# EasyEDA Pro project Steam Wand Attachment Controller.eprj

# Schematic Schematic1
Board Name: Board1; Create Date: 2025-08-12; Page Name: Steam Wand Schematic; Project Name: Steam Wand Attachment Controller; Schematic Name: Schematic1; Update Date: 2025-10-22; Company: EasyEDA.com; Page Size: A4; Version: V1.0
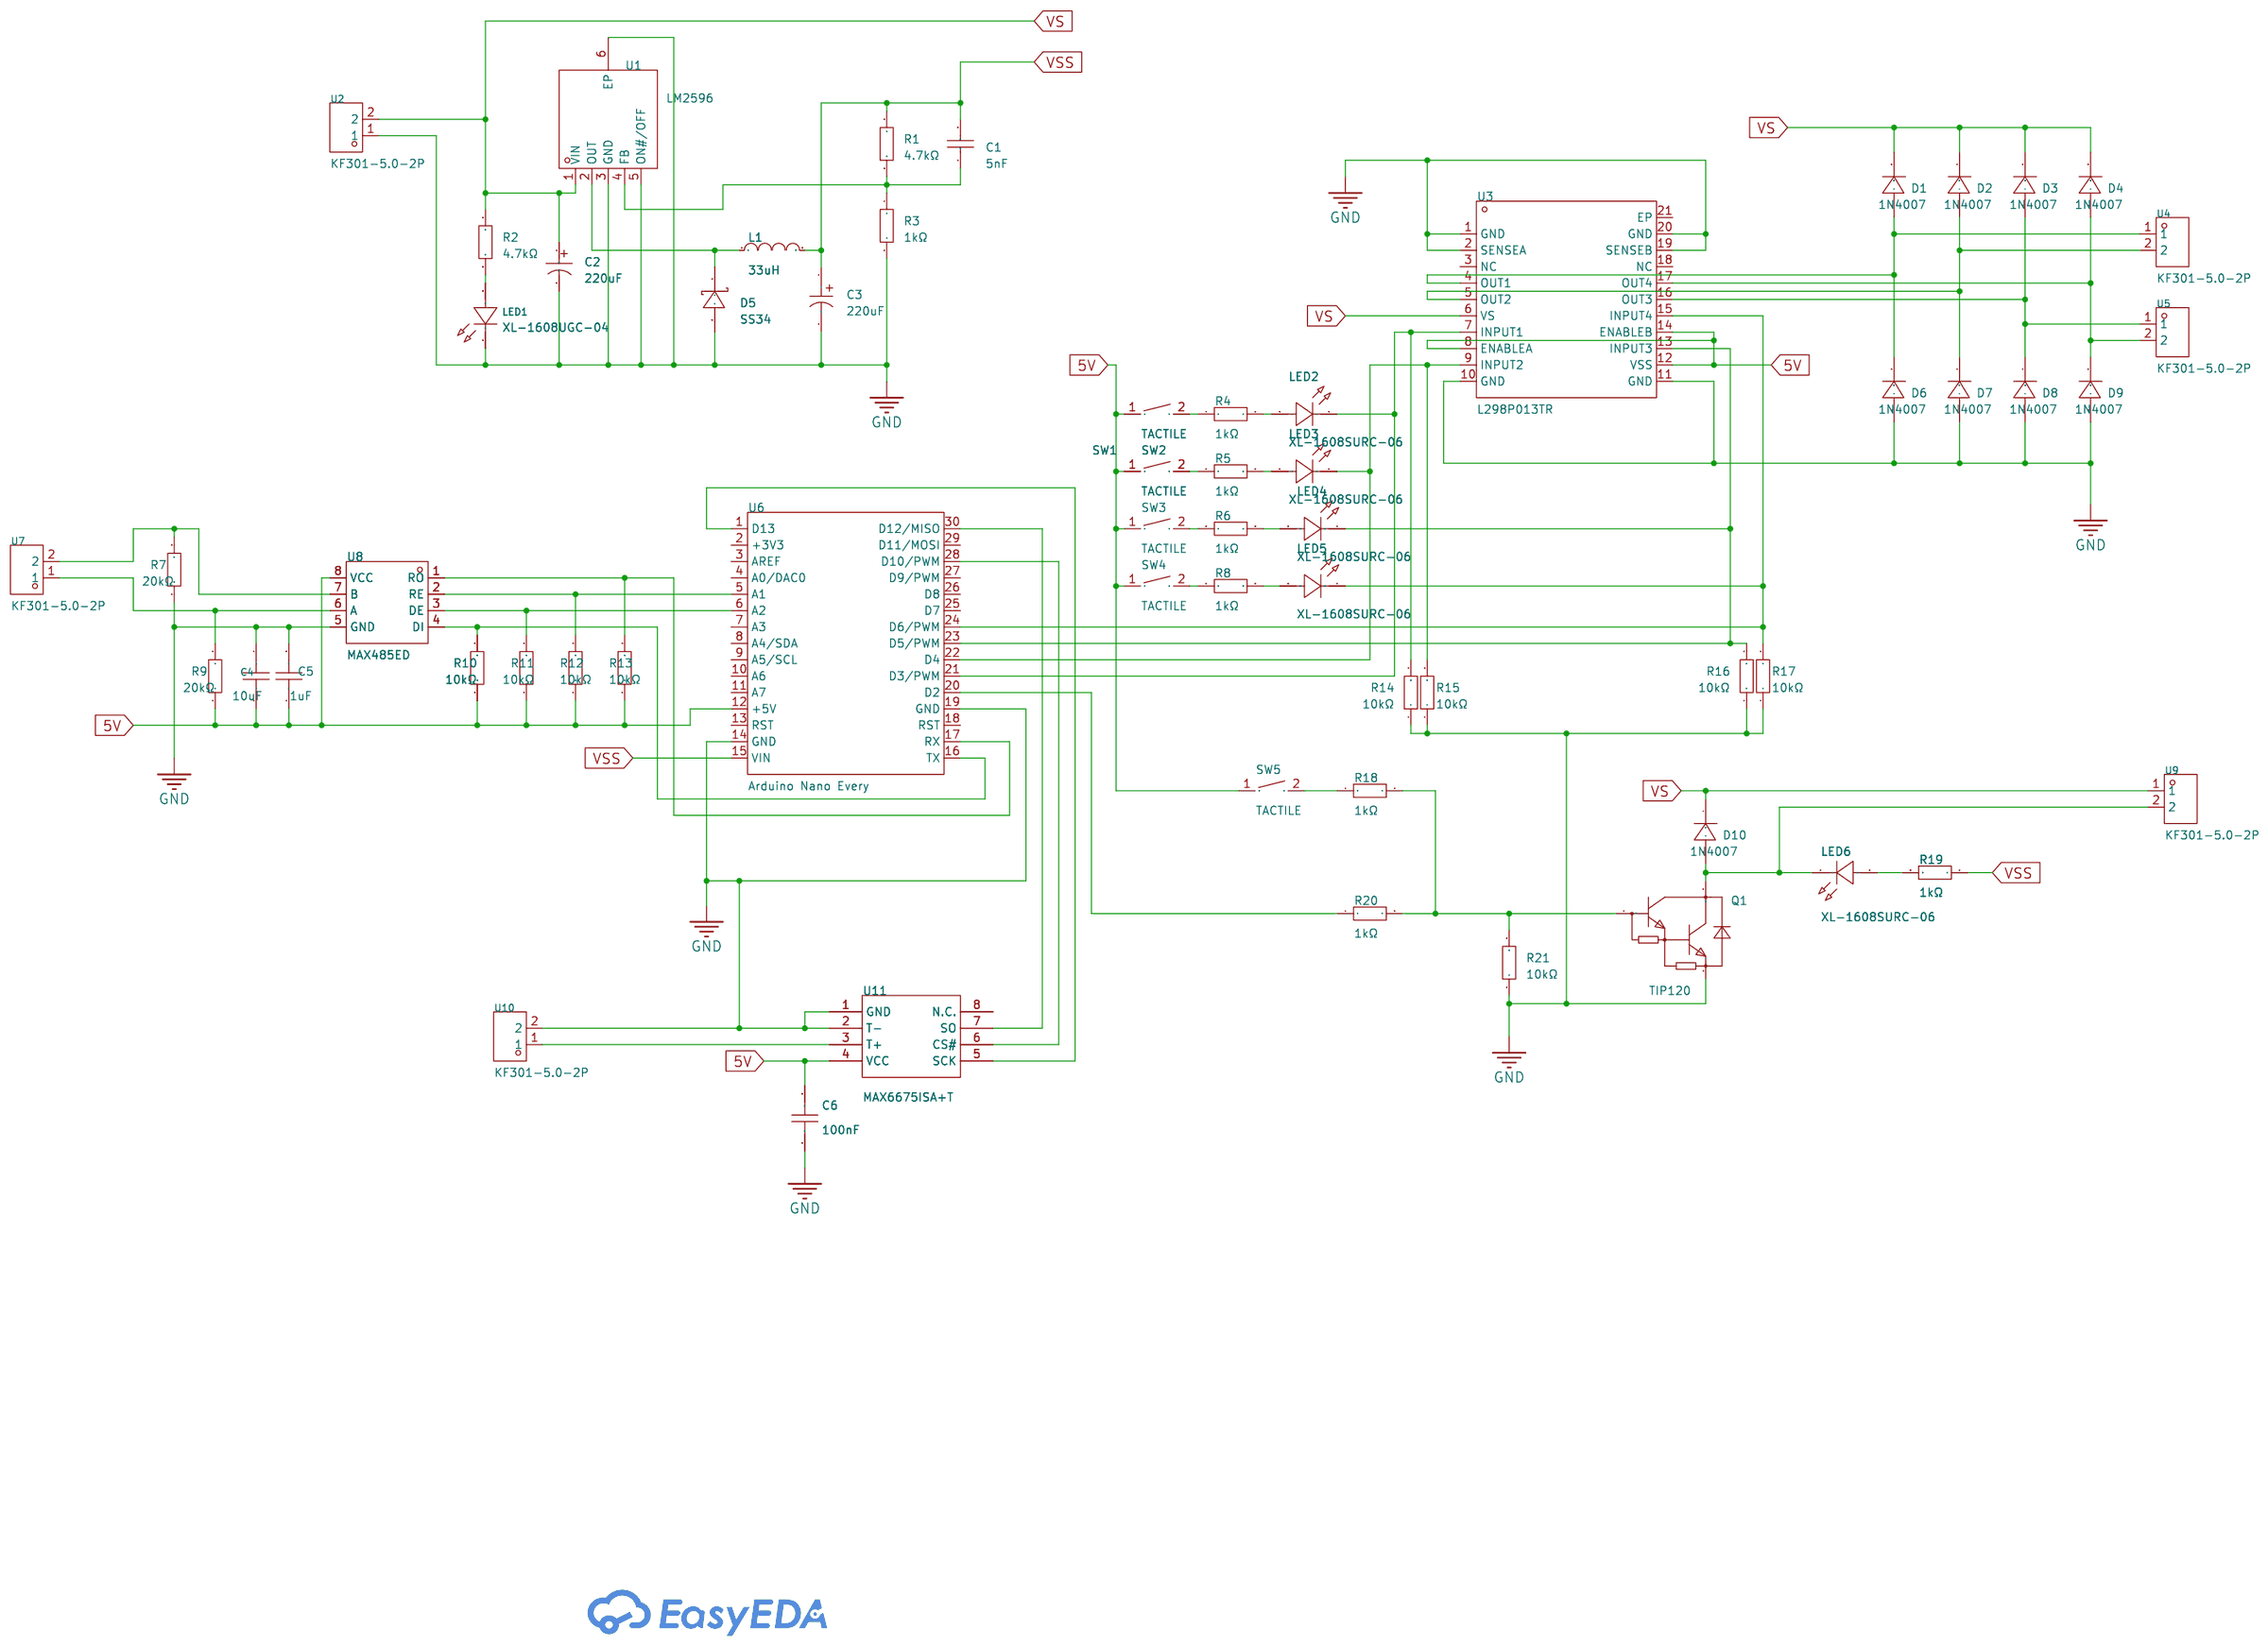
[diagram p0: schematic sheet]

## Parts
C1  5nF  [C0805]
C2  220uF  [CAP-SMD_BD10.0-L10.3-W10.3-LS11.3-FD]
C3  220uF  [CAP-SMD_BD6.3-L6.6-W6.6-LS7.4-FD]
C4  10uF  [C0603]
C5  1uF  [C0603]
C6  100nF  [C0603]
D1  1N4007  [SMAF_L3.5-W2.6-LS4.6-RD]
D2  1N4007  [SMAF_L3.5-W2.6-LS4.6-RD]
D3  1N4007  [SMAF_L3.5-W2.6-LS4.6-RD]
D4  1N4007  [SMAF_L3.5-W2.6-LS4.6-RD]
D5  SS34  [SMA_L4.3-W2.6-LS5.2-RD]
D6  1N4007  [SMAF_L3.5-W2.6-LS4.6-RD]
D7  1N4007  [SMAF_L3.5-W2.6-LS4.6-RD]
D8  1N4007  [SMAF_L3.5-W2.6-LS4.6-RD]
D9  1N4007  [SMAF_L3.5-W2.6-LS4.6-RD]
D10  1N4007  [SMAF_L3.5-W2.6-LS4.6-RD]
L1  33uH  [IND-SMD_L12.3-W12.3]
LED1  XL-1608UGC-04  [LED0603-RD_GREEN]
LED2  XL-1608SURC-06  [LED0603-RD_RED]
LED3  XL-1608SURC-06  [LED0603-RD_RED]
LED4  XL-1608SURC-06  [LED0603-RD_RED]
LED5  XL-1608SURC-06  [LED0603-RD_RED]
LED6  XL-1608SURC-06  [LED0603-RD_RED]
Q1  TIP120  [TO-220-3_L10.0-W4.5-P2.54-L]
R1  4.7kΩ  [R0603]
R2  4.7kΩ  [R0603]
R3  1kΩ  [R0603]
R4  1kΩ  [R0603]
R5  1kΩ  [R0603]
R6  1kΩ  [R0603]
R7  20kΩ  [R0603]
R8  1kΩ  [R0603]
R9  20kΩ  [R0603]
R10  10kΩ  [R0603]
R11  10kΩ  [R0603]
R12  10kΩ  [R0603]
R13  10kΩ  [R0603]
R14  10kΩ  [R0603]
R15  10kΩ  [R0603]
R16  10kΩ  [R0603]
R17  10kΩ  [R0603]
R18  1kΩ  [R0603]
R19  1kΩ  [R0603]
R20  1kΩ  [R0603]
R21  10kΩ  [R0603]
SW1  TACTILE  [KEY-SMD_L4.0-W3.0-LS4.9-1]
SW2  TACTILE  [KEY-SMD_L4.0-W3.0-LS4.9-1]
SW3  TACTILE  [KEY-SMD_L4.0-W3.0-LS4.9-1]
SW4  TACTILE  [KEY-SMD_L4.0-W3.0-LS4.9-1]
SW5  TACTILE  [KEY-SMD_L4.0-W3.0-LS4.9-1]
U1  LM2596  [TO-263-5_L10.2-W8.9-P1.70-BR]
U2  KF301-5.0-2P  [CONN-TH_P5.00_KF301-5.0-2P]
U3  L298P013TR  [POWERSO20_L15.9-W11.0-P1.27-LS14.2-BL-EP]
U4  KF301-5.0-2P  [CONN-TH_P5.00_KF301-5.0-2P]
U5  KF301-5.0-2P  [CONN-TH_P5.00_KF301-5.0-2P]
U6  Arduino Nano Every  [MOD-TH_ABX00028]
U7  KF301-5.0-2P  [CONN-TH_P5.00_KF301-5.0-2P]
U8  MAX485ED  [SOP-8_L4.9-W3.9-P1.27-LS6.0-BL]
U9  KF301-5.0-2P  [CONN-TH_P5.00_KF301-5.0-2P]
U10  KF301-5.0-2P  [CONN-TH_P5.00_KF301-5.0-2P]
U11  MAX6675ISA+T  [SOIC-8_L5.0-W4.0-P1.27-LS6.0-BL]

## Library data of the parts
C1 = 0805B502K500NT: Capacitance:5nF Tolerance:±10% Tolerance:±10% Voltage Rating:50V Temperature Coefficient:X7R; LCSC Part Name: 5nF ±10% 50V; Supplier Part: C1748; Manufacturer: FH(风华); Supplier Footprint: 0805; JLCPCB Part Class: Extended Part; Datasheet: https://atta.szlcsc.com/upload/public/pdf/source/20200305/C486355_26A10D38EF8C2A5C37091D0039909270.pdf; Supplier: LCSC; Tolerance: ±10%; Voltage Rating: 50V; Temperature Coefficient: X7R
C2 = RVT1H221M1010_C72499: Capacitance:220uF Tolerance:±20% Tolerance:±20% Voltage Rating:50V Ripple Current:230mA@120Hz Equivalent Series Resistance(ESR):- Diameter:10mm Height - Seated (Max):10.2mm Lifetime:2000hrs@105℃ Operating Temperature:-40℃~+105℃ Operating Temperature:-40℃~; LCSC Part Name: 220uF ±20% 50V; Supplier Part: C72499; Manufacturer: ROQANG(容强); Manufacturer Part: RVT1H221M1010; Supplier Footprint: SMD,D10xL10.2mm; JLCPCB Part Class: Extended Part; Datasheet: https://item.szlcsc.com/datasheet/RVT1H221M1010/73610.html; Supplier: LCSC; Tolerance: ±20%; Voltage Rating: 50V; Ripple Current: 230mA@120Hz; Diameter: 10mm; Height - Seated (Max): 10.2mm; Lifetime: 2000hrs@105℃; Operating Temperature: -40℃~+105℃
C3 = RVT1E221M0607: Capacitance: Tolerance:±20% Tolerance:±20% Voltage Rating: Ripple Current:150mA@120Hz Equivalent Series Resistance(ESR):- Diameter: Height - Seated (Max): Lifetime: Operating Temperature:-40℃~+105℃ Operating Temperature:-40℃~+105℃; LCSC Part Name: 220uF ±20% 25V; Supplier Part: C2918361; Manufacturer: ROQANG(容强); Supplier Footprint: SMD,D6.3xL7.7mm; JLCPCB Part Class: Extended Part; Datasheet: https://atta.szlcsc.com/upload/public/pdf/source/20241024/87413EF5140CF44BEEEC408A2EAB4036.pdf; Supplier: LCSC; Tolerance: ±20%; Ripple Current: 150mA@120Hz; Operating Temperature: -40℃~+105℃
C4 = CL10A106MQ8NNNC: Capacitance: Tolerance:±20% Tolerance:±20% Voltage Rated: Temperature Coefficient:; LCSC Part Name: 10uF ±20% 6.3V; Supplier Part: C1691; Manufacturer: SAMSUNG(三星); Supplier Footprint: 0603; JLCPCB Part Class: Extended Part; Datasheet: https://atta.szlcsc.com/upload/public/pdf/source/20160218/1457707763339.pdf; Supplier: LCSC; Tolerance: ±20%; Check: true
C5 = CL10A105KB8NNNC: Capacitance: Tolerance:±10% Tolerance:±10% Voltage Rated: Temperature Coefficient:; LCSC Part Name: 1uF ±10% 50V; Supplier Part: C15849; Manufacturer: SAMSUNG(三星); Supplier Footprint: 0603; JLCPCB Part Class: Basic Part; Datasheet: https://atta.szlcsc.com/upload/public/pdf/source/20160218/1457707763339.pdf; Supplier: LCSC; Tolerance: ±10%; Check: true
C6 = CC0603KRX7R9BB104: Capacitance:100nF Tolerance:±10% Tolerance:±10% Voltage Rating:50V Temperature Coefficient:X7R; LCSC Part Name: 100nF ±10% 50V; Supplier Part: C14663; Manufacturer: YAGEO(国巨); Supplier Footprint: 0603; JLCPCB Part Class: Basic Part; Datasheet: https://atta.szlcsc.com/upload/public/pdf/source/20250214/096C4C206003071F5D32E5F0D8E7F8DF.pdf; Supplier: LCSC; Tolerance: ±10%; Voltage Rating: 50V; Temperature Coefficient: X7R; Check: true
D1-D4 D6-D10 = 1N4007_C41421295: Diode Configuration:Independent Type Voltage - Forward(Vf@If):1.1V Voltage - DC Reverse(Vr):1kV Current - Rectified: Reverse Leakage Current (Ir):5uA; LCSC Part Name: IF:1A VR:1000V VF:1.1V; Supplier Part: C41421295; Manufacturer: HXY MOSFET(华轩阳电子); Supplier Footprint: SMAF; JLCPCB Part Class: Extended Part; Datasheet: https://atta.szlcsc.com/upload/public/pdf/source/20240930/C27316F7E93F97859CF391B8C628EF90.pdf; Supplier: LCSC; Diode Configuration: Independent Type; Voltage - Forward(Vf@If): 1.1V; Voltage - DC Reverse(Vr): 1kV; Reverse Leakage Current (Ir): 5uA
D5 = SS34_C8678: Diode Configuration:Independent Voltage - Forward(Vf@If):550mV@3A Voltage - DC Reverse(Vr):40V Current - Rectified:3A Reverse Leakage Current (Ir):500uA@40V Operating Junction Temperature Range:-55℃~+125℃ Operating Junction Temperature Range:-55℃~+125℃; LCSC Part Name: 电压:40V 电流:3A; Supplier Part: C8678; Manufacturer: MDD(辰达半导体); Supplier Footprint: SMA(DO-214AC); JLCPCB Part Class: Basic Part; Datasheet: https://item.szlcsc.com/datasheet/SS34/9178.html; Supplier: LCSC; Diode Configuration: Independent; Voltage - Forward(Vf@If): 550mV@3A; Voltage - DC Reverse(Vr): 40V; Current - Rectified: 3A; Reverse Leakage Current (Ir): 500uA@40V; Operating Junction Temperature Range: -55℃~+125℃
L1 = SMDRI127-330MT: Inductance: Tolerance:±20% Tolerance:±20% Rated Current: Saturation Current (Isat):5.5A DC Resistance (DCR): Type:屏蔽电感; LCSC Part Name: 33uH ±20% 5.5A; Supplier Part: C9400; Manufacturer: SXN(顺翔诺); Supplier Footprint: SMD,12.3x12.3mm; JLCPCB Part Class: Extended Part; Datasheet: https://atta.szlcsc.com/upload/public/pdf/source/20210810/6F96FDC19AA308DD2AD166FFB9640E87.pdf; Supplier: LCSC; Tolerance: ±20%; Saturation Current (Isat): 5.5A; Type: 屏蔽电感
LED1 = XL-1608UGC-04: Lamp Holder Type:- Illumination Color:Emerald Green Voltage - Forward(Vf):3.3V Voltage - Forward(Vf):3.3V Power(Watts):70mW Forward Current:20mA Wavelength - Dominant:515nm~535nm Wavelength - Dominant:515nm~535nm Peak Wavelength:525nm Diode Configuration:; Supplier Part: C965804; Manufacturer: XINGLIGHT(成兴光); Supplier Footprint: 0603; JLCPCB Part Class: Extended Part; Datasheet: https://atta.szlcsc.com/upload/public/pdf/source/20250225/C314F1E3DD818220782E352D4A9DC75E.pdf; Supplier: LCSC; Illumination Color: Emerald Green; Voltage - Forward(Vf): 3.3V; Power(Watts): 70mW; Forward Current: 20mA; Wavelength - Dominant: 515nm~535nm; Peak Wavelength: 525nm; Diode Configuration: Discrete Diode; Lens Color: Water Clear; Luminous Intensity: 810mcd; Viewing Angle: 120°; Mounting Style: op View Mount; Check: true
LED2-LED6 = XL-1608SURC-06: Lamp Holder Type:- Illumination Color:Red Voltage - Forward(Vf):2.3V Voltage - Forward(Vf):2.3V Power(Watts):50mW Forward Current:20mA Wavelength - Dominant:620nm~630nm Wavelength - Dominant:620nm~630nm Peak Wavelength:625nm Diode Configuration:- Lens Col; Supplier Part: C965799; Manufacturer: XINGLIGHT(成兴光); Supplier Footprint: 0603; JLCPCB Part Class: Extended Part; Datasheet: https://atta.szlcsc.com/upload/public/pdf/source/20250213/F9766CE804AF391355DCDD48DB3E0DAB.pdf; Supplier: LCSC; Illumination Color: Red; Voltage - Forward(Vf): 2.3V; Power(Watts): 50mW; Forward Current: 20mA; Wavelength - Dominant: 620nm~630nm; Peak Wavelength: 625nm; Lens Color: Colorless Transparent Lens; Luminous Intensity: 225mcd; Viewing Angle: 120°; Mounting Sytle: Positive Stick; Operating Temperature: -20℃~+85℃; Check: true
Q1 = TIP120_C262990: Transistor Type:NPN Collector-emitter voltage (Vceo):60V DC current gain (hFE@Vce,Ic):1000@3V,3A DC current gain (hFE@Vce,Ic):1000@3V,3A Power Dissipation (Pd):2W Collector Current (Ic):5A Transition frequency (fT):- Collector cut-off current (Icbo@Vcb):5; LCSC Part Name: NPN 耐压:60V 电流:5A; Supplier Part: C262990; Manufacturer: ST(意法半导体); Supplier Footprint: TO-220; JLCPCB Part Class: Extended Part; Datasheet: https://atta.szlcsc.com/upload/public/pdf/source/20180806/C262990_0EE67BD9C596AF827C63E15CA7C78F26.pdf; Supplier: LCSC; Transistor Type: NPN; Collector-emitter voltage (Vceo): 60V; DC current gain (hFE@Vce,Ic): 1000@3V,3A; Power Dissipation (Pd): 2W; Collector Current (Ic): 5A; Collector cut-off current (Icbo@Vcb): 500uA; Collector-emitter saturation voltage (VCE(sat)@Ic,Ib): 4V@5A,20mA; Check: true
R1 R2 = 0603WAF4701T5E: Type:Thick Film Resistor Resistance:4.7kΩ Tolerance:±1% Tolerance:±1% Power(Watts):100mW Voltage-Supply(Max):75V Temperature Coefficient:±100ppm/℃ Temperature Coefficient:±100ppm/℃ Operating Temperature:-55℃~+155℃ Operating Temperature:-55℃~+155℃; LCSC Part Name: 4.7kΩ ±1% 100mW 厚膜电阻; Supplier Part: C23162; Manufacturer: UNI-ROYAL(厚声); Supplier Footprint: 0603; JLCPCB Part Class: Basic Part; Datasheet: https://item.szlcsc.com/datasheet/0603WAF4701T5E/23889.html; Supplier: LCSC; Type: Thick Film Resistor; Tolerance: ±1%; Power(Watts): 100mW; Voltage-Supply(Max): 75V; Temperature Coefficient: ±100ppm/℃; Operating Temperature: -55℃~+155℃
R3 = 0603WAF1001T5E: Type:Thick Film Resistors Resistance:1kΩ Tolerance:±1% Tolerance:±1% Power(Watts): Overload Voltage (Max): Temperature Coefficient:±100ppm/℃ Temperature Coefficient:±100ppm/℃ Operating Temperature Range:-55℃~+155℃ Operating Temperature Range:-55℃~+155℃; LCSC Part Name: 1kΩ ±1% 100mW 厚膜电阻; Supplier Part: C21190; Manufacturer: UNI-ROYAL(厚声); Supplier Footprint: 0603; JLCPCB Part Class: Basic Part; Datasheet: https://atta.szlcsc.com/upload/public/pdf/source/20200306/C422600_1E6D84923E4A46A82E41ADD87F860B5C.pdf; Supplier: LCSC; Type: Thick Film Resistors; Tolerance: ±1%; Temperature Coefficient: ±100ppm/℃; Operating Temperature Range: -55℃~+155℃
R4-R6 R8 R19 R20 = 0603WAF1001T5E: Type:Thick Film Resistors Resistance:1kΩ Tolerance:±1% Tolerance:±1% Power(Watts): Overload Voltage (Max): Temperature Coefficient:±100ppm/℃ Temperature Coefficient:±100ppm/℃ Operating Temperature Range:-55℃~+155℃ Operating Temperature Range:-55℃~+155℃; LCSC Part Name: 1kΩ ±1% 100mW 厚膜电阻; Supplier Part: C21190; Manufacturer: UNI-ROYAL(厚声); Supplier Footprint: 0603; JLCPCB Part Class: Basic Part; Datasheet: https://atta.szlcsc.com/upload/public/pdf/source/20200306/C422600_1E6D84923E4A46A82E41ADD87F860B5C.pdf; Supplier: LCSC; Type: Thick Film Resistors; Tolerance: ±1%; Temperature Coefficient: ±100ppm/℃; Operating Temperature Range: -55℃~+155℃; Check: true
R7 R9 = SCR0603J20K: Type:Thick Film Resistors Resistance: Tolerance:±5% Tolerance:±5% Power(Watts): Overload Voltage (Max): Operating Temperature Range:-55℃~+155℃ Operating Temperature Range:-55℃~+155℃; LCSC Part Name: 厚膜电阻 20kΩ ±5% 100mW; Supplier Part: C3017708; Manufacturer: VO(翔胜); Supplier Footprint: 0603; JLCPCB Part Class: Extended Part; Datasheet: https://atta.szlcsc.com/upload/public/pdf/source/20220513/247AF9639BA21CF93567DC289CCC6A22.pdf; Supplier: LCSC; Type: Thick Film Resistors; Tolerance: ±5%; Operating Temperature Range: -55℃~+155℃; Check: true
R10-R17 R21 = RC0603FR-0710KL: Type:Thick Film Resistors Resistance: Tolerance:±1% Tolerance:±1% Power(Watts): Overload Voltage (Max): Temperature Coefficient:±100ppm/℃ Temperature Coefficient:±100ppm/℃ Operating Temperature Range:-55℃~+155℃ Operating Temperature Range:-55℃~+155℃; LCSC Part Name: 厚膜电阻 10kΩ ±1% 100mW; Supplier Part: C98220; Manufacturer: YAGEO(国巨); Supplier Footprint: 0603; JLCPCB Part Class: Extended Part; Datasheet: https://atta.szlcsc.com/upload/public/pdf/source/20180927/C295883_E8D83085EA81BD7DE0B2B681138C15EE.pdf; Supplier: LCSC; Type: Thick Film Resistors; Tolerance: ±1%; Temperature Coefficient: ±100ppm/℃; Operating Temperature Range: -55℃~+155℃; Check: true
R18 = 0603WAF1001T5E: Type:Thick Film Resistors Resistance:1kΩ Tolerance:±1% Tolerance:±1% Power(Watts): Overload Voltage (Max): Temperature Coefficient:±100ppm/℃ Temperature Coefficient:±100ppm/℃ Operating Temperature Range:-55℃~+155℃ Operating Temperature Range:-55℃~+155℃; LCSC Part Name: 1kΩ ±1% 100mW 厚膜电阻; Supplier Part: C21190; Manufacturer: UNI-ROYAL(厚声); Manufacturer Part: z; Supplier Footprint: 0603; JLCPCB Part Class: Basic Part; Datasheet: https://atta.szlcsc.com/upload/public/pdf/source/20200306/C422600_1E6D84923E4A46A82E41ADD87F860B5C.pdf; Supplier: LCSC; Type: Thick Film Resistors; Tolerance: ±1%; Temperature Coefficient: ±100ppm/℃; Operating Temperature Range: -55℃~+155℃; Check: true
SW1-SW5 = HX 3x4x2-2P-1.6N TACTILE SWITCH: Circuit:SPST Actuator Style:Round Button Operating Force:1.6N Mounting Type:Surface Mount,Vertical Length:4mm Width:3mm Switch Height:2mm with Bracket:Without Bracket Contact Current:50mA Voltage Rating:12V Actuator/Cap Color:Black With Lamp:No IP Rating:; LCSC Part Name: 4*3*2mm 立贴 轻触开关; Supplier Part: C49234124; Manufacturer: hanxia(韩下); Supplier Footprint: SMD; JLCPCB Part Class: Extended Part; Datasheet: https://atta.szlcsc.com/upload/public/pdf/source/20250618/DEAE967E8C60E890408FF778A6F6CC32.pdf; Supplier: LCSC; Circuit: SPST; Actuator Style: Round Button; Operating Force: 1.6N; Mounting Type: Surface Mount,Vertical; Length: 4mm; Width: 3mm; Switch Height: 2mm; with Bracket: Without Bracket; Contact Current: 50mA; Voltage Rating: 12V; Actuator/Cap Color: Black; With Lamp: No; Termination Style: SMD(SMT) Tab; Life: 100,000 Cycles; Check: true
U1 = LM2596S-5.0(UMW): Function:Step-down type Output Type:Fixed Input Voltage:7V~40V Input Voltage:7V~40V Output Voltage:5V Output Voltage:5V Output Current:3A Switching Frequency:150kHz Switching Frequency:150kHz Operating Temperature:-40℃~+125℃@(TA) Operating Temperature:-40; LCSC Part Name: 3A降压稳压器; Supplier Part: C347421; Manufacturer: UMW(友台半导体); Supplier Footprint: TO-263-5; JLCPCB Part Class: Extended Part; Datasheet: https://atta.szlcsc.com/upload/public/pdf/source/20241113/7515F50B4FEE0270D4DE7078364C87FA.pdf; Supplier: LCSC; Function: Step-down type; Output Type: Fixed; Input Voltage: 7V~40V; Output Voltage: 5V; Output Current: 3A; Switching Frequency: 150kHz; Operating Temperature: -40℃~+125℃@(TA); Synchronous Rectification: No; Number of Outputs: 1; Topology: Step-down; Quiescent Current (Iq): 80uA; Switch tube (built-in/external): Built-in
U2 U4 U5 U7 U9 U10 = KF301-5.0-2P: Structure:1x2P Pitch:5mm Color:Blue Mounting Style:Straight Current Rating (Max):17A Voltage Rating (Max):250V Number of Pins:2P Number of Rows:1 Wire Gauge - AWG:14~22 Wire Gauge - AWG:14~22 Wire Gauge - mm2:1.5 Wire Gauge - mm2:1.5 Number of PINs Per Ro; LCSC Part Name: 5mm 1x2P 排数:1 每排P数:2 直插; Supplier Part: C474881; Manufacturer: KEFA(科发); Supplier Footprint: 插件,P=5mm; JLCPCB Part Class: Extended Part; Datasheet: https://atta.szlcsc.com/upload/public/pdf/source/20230317/03A5B5FC229D6F9225E8F51DA1A4E80A.pdf; Supplier: LCSC; Structure: 1x2P; Pitch: 5mm; Color: Blue; Mounting Style: Straight; Current Rating (Max): 17A; Voltage Rating (Max): 250V; Number of Pins: 2P; Number of Rows: 1; Wire Gauge - AWG: 14~22; Wire Gauge - mm2: 1.5; Number of PINs Per Row: 2; Operating Temperature Range: -30℃~+120℃
U3 = L298P013TR: Supplier Part: C111210; Manufacturer: ST(意法半导体); Supplier Footprint: PowerSO-20; JLCPCB Part Class: Extended Part; Datasheet: https://atta.szlcsc.com/upload/public/pdf/source/20181012/C111210_C12A10AEDADDE80938E7DEEDD1F73B12.pdf; Supplier: LCSC
U6 = ABX00028: Supplier Part: C21303176; Manufacturer: arduino; JLCPCB Part Class: Extended Part; Datasheet: https://atta.szlcsc.com/upload/public/pdf/source/20240516/DBE20BC6A27351D8B1B352A6E0678D57.pdf; Supplier: LCSC; Check: true
U8 = MAX485ED: LCSC Part Name: 低功耗、限摆率的RS-485/RS-422收发器; Supplier Part: C481667; Manufacturer: HTC; Supplier Footprint: SOP-8; JLCPCB Part Class: Extended Part; Datasheet: https://atta.szlcsc.com/upload/public/pdf/source/20200113/C481667_86CA12344B2034BBC3F3085D860BEB7C.pdf; Supplier: LCSC; Check: true
U11 = MAX6675ISA+T: Supply Current: Operating Temperature: Type: Input Type:- Output Type:-; LCSC Part Name: MAX6675ISA; Supplier Part: C16030; Manufacturer: MAXIM(美信); Supplier Footprint: SOIC-8_150mil; JLCPCB Part Class: Extended Part; Datasheet: https://atta.szlcsc.com/upload/public/pdf/source/20170713/C16030_1499918913843816819.pdf; Supplier: LCSC; Check: true

## Nets
5V: C4.1 C5.1 C6.1 R9.1 R10.1 R11.1 R12.1 R13.1 SW1.1 SW2.1 SW3.1 SW4.1 SW5.1 U3.8(ENABLEA) U3.12(VSS) U3.14(ENABLEB) U6.12(+5V) U8.8(VCC) U11.4(VCC)
GND: C2.2 C3.2 C4.2 C5.2 C6.2 D5.2(A) D6.2(A) D7.2(A) D8.2(A) D9.2(A) LED1.1(K) Q1.3(E) R3.2 R7.1 R14.1 R15.1 R16.1 R17.1 R21.1 U1.3(GND) U1.5(ON#/OFF) U1.6(EP) U2.1 U3.1(GND) U3.2(SENSEA) U3.10(GND) U3.11(GND) U3.19(SENSEB) U3.20(GND) U6.14(GND) U6.19(GND) U8.5(GND) U10.2 U11.1(GND) U11.2(T-)
VSS: C1.2 C3.1 L1.2 R1.1 R19.1 U6.15(VIN)
VS: C2.1 D1.1(C) D2.1(C) D3.1(C) D4.1(C) D10.1(C) R2.1 U1.1(VIN) U2.2 U3.6(VS) U9.1
$1N3030: D1.2(A) D6.1(C) U3.4(OUT1) U4.1
$1N3036: D2.2(A) D7.1(C) U3.5(OUT2) U4.2
$1N3042: D3.2(A) D8.1(C) U3.16(OUT3) U5.1
$1N3046: D4.2(A) D9.1(C) U3.17(OUT4) U5.2
$1N3341: U10.1 U11.3(T+)
$1N3541: U6.28(D10/PWM) U11.6(CS#)
$1N3558: U6.30(D12/MISO) U11.7(SO)
$1N3567: U6.1(D13) U11.5(SCK)
$1N3578: LED2.1(K) R14.2 U3.7(INPUT1) U6.21(D3/PWM)
$1N3584: LED3.1(K) R15.2 U3.9(INPUT2) U6.22(D4)
$1N4819: R4.1 SW1.2
$1N4823: R5.1 SW2.2
$1N4828: R6.1 SW3.2
$1N4833: R8.1 SW4.2
$1N4893: R20.1 U6.20(D2)
$1N6211: R18.1 SW5.2
$1N6777: LED2.2(A) R4.2
$1N6840: LED3.2(A) R5.2
$1N6942: LED4.2(A) R6.2
$1N6949: LED4.1(K) R16.2 U3.13(INPUT3) U6.23(D5/PWM)
$1N6952: LED5.2(A) R8.2
$1N6959: LED5.1(K) R17.2 U3.15(INPUT4) U6.24(D6/PWM)
$1N7366: Q1.1(B) R18.2 R20.2 R21.2
$1N9309: D10.2(A) LED6.1(K) Q1.2(C) U9.2
$1N10798: R10.2 U6.16(TX) U8.4(DI)
$1N10809: R13.2 U6.17(RX) U8.1(RO)
$1N10831: R12.2 U6.5(A1) U8.2(RE)
$1N10835: R11.2 U6.6(A2) U8.3(DE)
$1N11820: R9.2 U7.1 U8.6(A)
$1N11831: R7.2 U7.2 U8.7(B)
$1N15964: LED6.2(A) R19.2
$1N33170: D5.1(K) L1.1 U1.2(OUT)
$1N33171: C1.1 R1.2 R3.1 U1.4(FB)
$1N33173: LED1.2(A) R2.2

Not connected (* = marked no-connect by the designer): U3 3(NC) 18(NC) 21(EP); U6 2(+3V3) 3(AREF) 4(A0/DAC0) 7(A3) 8(A4/SDA) 9(A5/SCL) 10(A6) 11(A7) 13(RST) 18(RST) 25(D7) 26(D8) 27(D9/PWM) 29(D11/MOSI); U11 8(N.C.)

# Board PCB V2
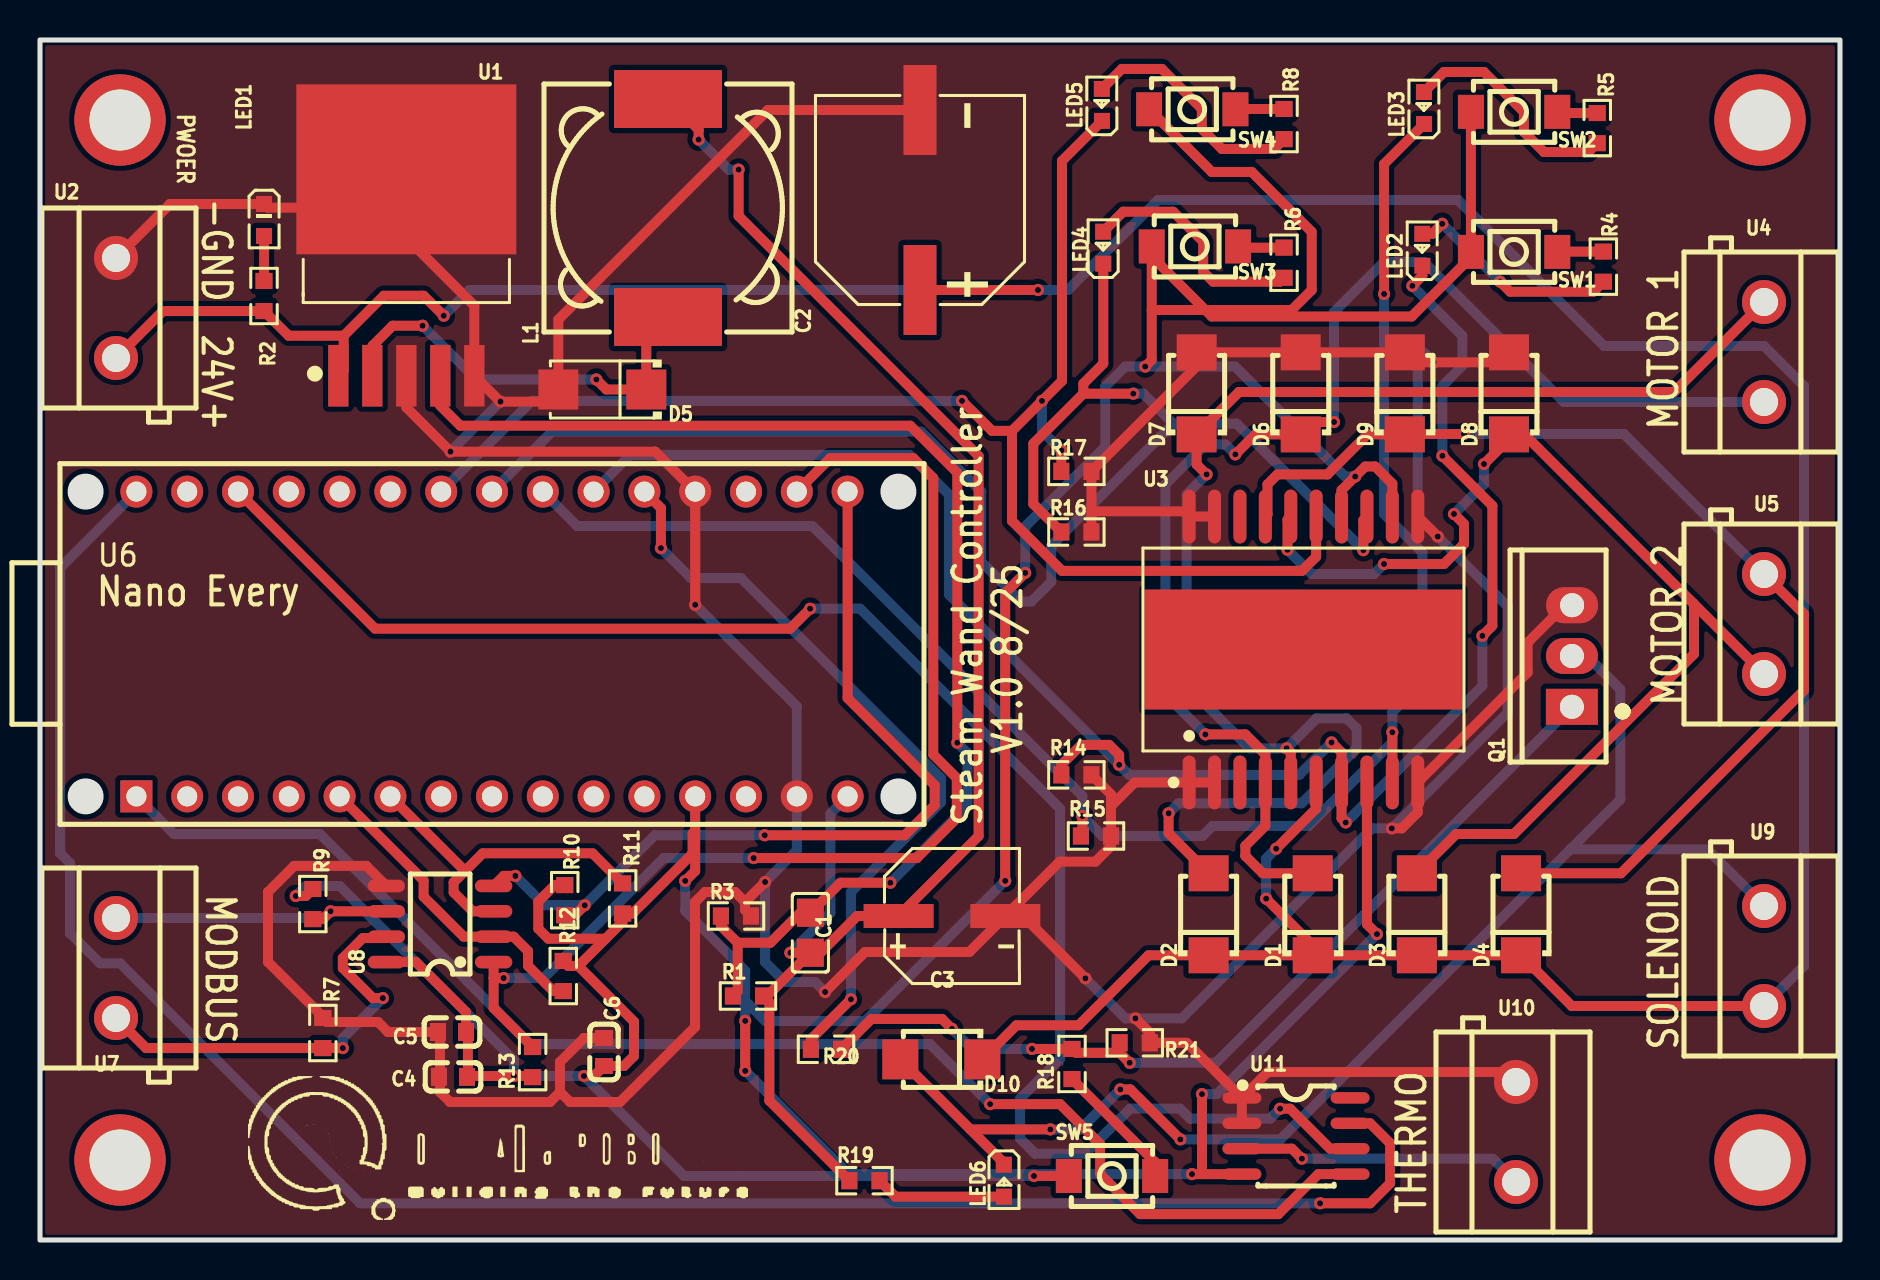
[diagram p1: board, top side]
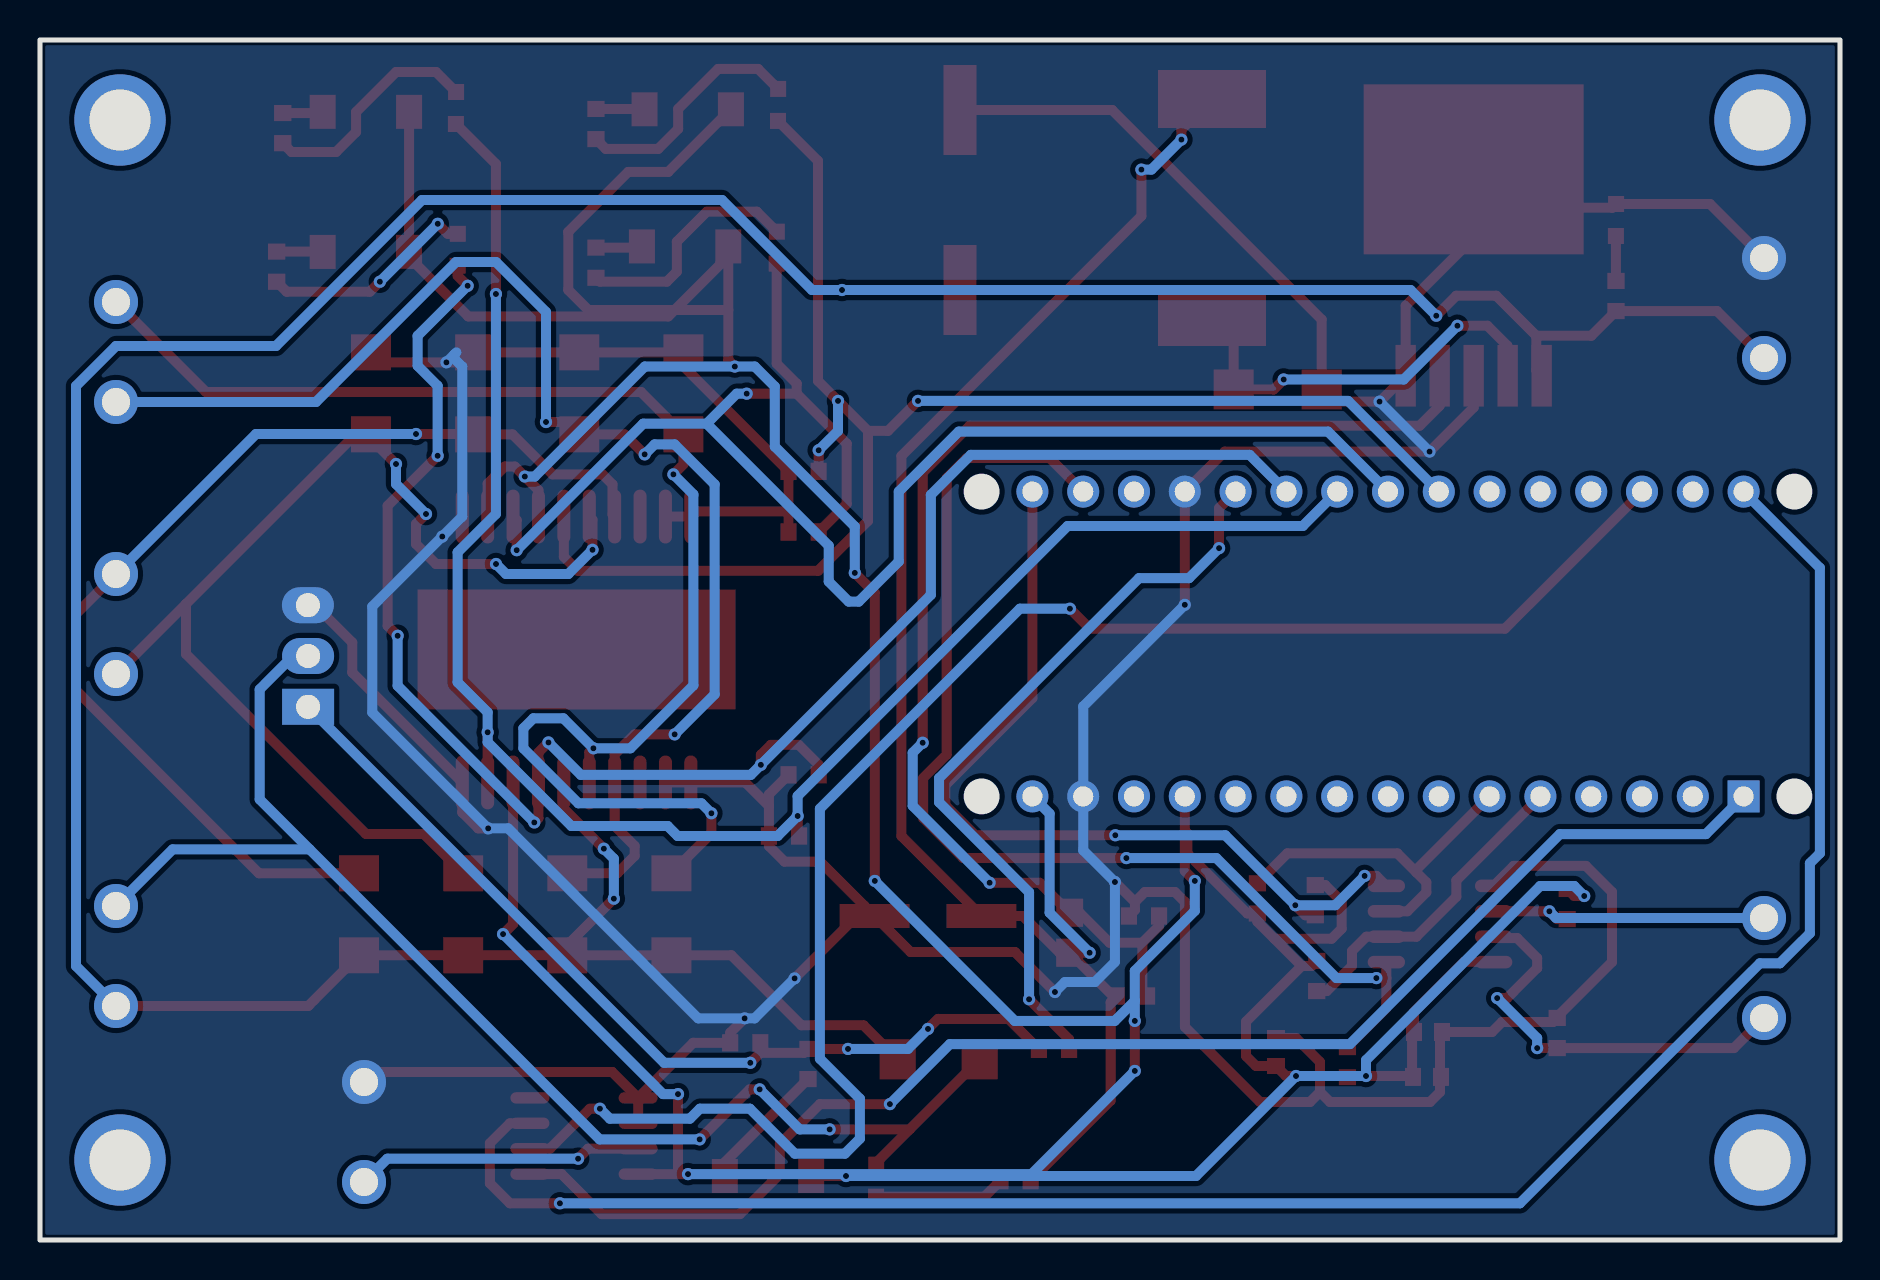
[diagram p2: board, bottom side, seen from below]

Outline 90 x 60 mm; copper layers: Top Layer, Bottom Layer. Coordinates in mm from the lower left corner of the outline.
Outline path: rectangle 0,60 90,0
Stack: Top Layer 0.035mm / Dielectric1 1.51mm FR4 er 4.5 / Bottom Layer 0.035mm

## Design rules (mm)
template: Custom Config
spacing copperThickness1oz (default): track to track 0.5, other pairs 0.152 to 0.3
spacing copperThickness2oz: track to track 0.203, other pairs 0.152 to 0.3
track width copperThickness1oz (default): min 0.2, default 0.5, max 2.54
track width copperThickness2oz: min 0.203, default 0.254, max 2.54
differential pair differentialPair (default): width min 0.127, default 0.254, max 2.54; gap min 0.152, default 0.152
via viaSize (default): diameter min 0.5, default 0.61, max 10; hole min 0.3, default 0.305, max 6.3

## Placement (name value [footprint] x y rotation side)
C1  5nF  [C0805]  38.52 15.36 270 top
C2  220uF  [CAP-SMD_BD10.0-L10.3-W10.3-LS11.3-FD]  44 52 90 top
C3  220uF  [CAP-SMD_BD6.3-L6.6-W6.6-LS7.4-FD]  45.6 16.2 0 top
C4  10uF  [C0603]  20.65 8.16 180 top
C5  1uF  [C0603]  20.6 10.4 180 top
C6  100nF  [C0603]  28.2 9.4 90 top
D1  1N4007  [SMAF_L3.5-W2.6-LS4.6-RD]  63.64 16.29 90 top
D2  1N4007  [SMAF_L3.5-W2.6-LS4.6-RD]  58.43 16.29 90 top
D3  1N4007  [SMAF_L3.5-W2.6-LS4.6-RD]  68.84 16.29 90 top
D4  1N4007  [SMAF_L3.5-W2.6-LS4.6-RD]  74.05 16.29 90 top
D5  SS34  [SMA_L4.3-W2.6-LS5.2-RD]  28.12 42.53 180 top
D6  1N4007  [SMAF_L3.5-W2.6-LS4.6-RD]  63.04 42.33 90 top
D7  1N4007  [SMAF_L3.5-W2.6-LS4.6-RD]  57.83 42.33 90 top
D8  1N4007  [SMAF_L3.5-W2.6-LS4.6-RD]  73.45 42.33 90 top
D9  1N4007  [SMAF_L3.5-W2.6-LS4.6-RD]  68.24 42.33 90 top
D10  1N4007  [SMAF_L3.5-W2.6-LS4.6-RD]  45.07 9.03 180 top
L1  33uH  [IND-SMD_L12.3-W12.3]  31.4 51.6 90 top
LED1  XL-1608UGC-04  [LED0603-RD_GREEN]  11.2 51 270 top
LED2  XL-1608SURC-06  [LED0603-RD_RED]  69.12 49.51 90 top
LED3  XL-1608SURC-06  [LED0603-RD_RED]  69.2 56.6 90 top
LED4  XL-1608SURC-06  [LED0603-RD_RED]  53.16 49.62 90 top
LED5  XL-1608SURC-06  [LED0603-RD_RED]  53.1 56.75 90 top
LED6  XL-1608SURC-06  [LED0603-RD_RED]  48.19 2.97 270 top
NOREF  -  [Pad_e106]  4 56 0 top
NOREF#2  -  [Pad_e2]  86 4 0 top
NOREF#3  -  [Pad_e3]  86 56 0 top
NOREF#4  -  [Pad_e1]  4 4 0 top
Q1  TIP120  [TO-220-3_L10.0-W4.5-P2.54-L]  76.6 29.2 90 top
R1  4.7kΩ  [R0603]  35.4 12.2 180 top
R2  4.7kΩ  [R0603]  11.2 47.2 90 top
R3  1kΩ  [R0603]  34.8 16.2 0 top
R4  1kΩ  [R0603]  78.17 48.67 270 top
R5  1kΩ  [R0603]  77.86 55.59 270 top
R6  1kΩ  [R0603]  62.2 48.86 270 top
R7  20kΩ  [R0603]  14.14 10.35 270 top
R8  1kΩ  [R0603]  62.2 55.8 270 top
R9  20kΩ  [R0603]  13.64 16.8 270 top
R10  10kΩ  [R0603]  26.24 16.99 270 top
R11  10kΩ  [R0603]  29.13 17.08 90 top
R12  10kΩ  [R0603]  26.16 13.2 270 top
R13  10kΩ  [R0603]  24.63 8.9 90 top
R14  10kΩ  [R0603]  51.82 23.26 180 top
R15  10kΩ  [R0603]  52.8 20.2 180 top
R16  10kΩ  [R0603]  51.82 35.4 180 top
R17  10kΩ  [R0603]  51.82 38.43 180 top
R18  1kΩ  [R0603]  51.6 8.8 90 top
R19  1kΩ  [R0603]  41.22 2.97 0 top
R20  1kΩ  [R0603]  39.3 9.54 0 top
R21  10kΩ  [R0603]  54.74 9.86 180 top
SW1  TACTILE  [KEY-SMD_L4.0-W3.0-LS4.9-1]  73.71 49.41 0 top
SW2  TACTILE  [KEY-SMD_L4.0-W3.0-LS4.9-1]  73.71 56.41 0 top
SW3  TACTILE  [KEY-SMD_L4.0-W3.0-LS4.9-1]  57.75 49.68 0 top
SW4  TACTILE  [KEY-SMD_L4.0-W3.0-LS4.9-1]  57.61 56.54 0 top
SW5  TACTILE  [KEY-SMD_L4.0-W3.0-LS4.9-1]  53.6 3.2 0 top
U1  LM2596  [TO-263-5_L10.2-W8.9-P1.70-BR]  18.32 48.37 270 top
U2  KF301-5.0-2P  [CONN-TH_P5.00_KF301-5.0-2P]  3.8 46.6 270 top
U3  L298P013TR  [POWERSO20_L15.9-W11.0-P1.27-LS14.2-BL-EP]  63.17 29.53 0 top
U4  KF301-5.0-2P  [CONN-TH_P5.00_KF301-5.0-2P]  86.2 44.4 90 top
U5  KF301-5.0-2P  [CONN-TH_P5.00_KF301-5.0-2P]  86.2 30.8 90 top
U6  Arduino Nano Every  [MOD-TH_ABX00028]  22.6 29.8 90 top
U7  KF301-5.0-2P  [CONN-TH_P5.00_KF301-5.0-2P]  3.8 13.6 270 top
U8  MAX485ED  [SOP-8_L4.9-W3.9-P1.27-LS6.0-BL]  20 15.8 90 top
U9  KF301-5.0-2P  [CONN-TH_P5.00_KF301-5.0-2P]  86.2 14.2 90 top
U10  KF301-5.0-2P  [CONN-TH_P5.00_KF301-5.0-2P]  73.8 5.4 90 top
U11  MAX6675ISA+T  [SOIC-8_L5.0-W4.0-P1.27-LS6.0-BL]  62.8 5.2 270 top

## Footprints (pads in the part's own frame, mm; a bottom-side part is the same pattern mirrored in y, then rotated)
C0603
  rect 0.8x0.9 smd: 1(-0.7,0) 2(0.7,0)
C0805
  rect 1.41x1.35 smd: 1(-1,0) 2(1,0)
CAP-SMD_BD6.3-L6.6-W6.6-LS7.4-FD
  rect 3.5x1.2 smd: 1(-2.67,0) 2(2.67,0)
CAP-SMD_BD10.0-L10.3-W10.3-LS11.3-FD
  rect 4.5x1.65 smd: 1(-4.5,0) 2(4.5,0)
CONN-TH_P5.00_KF301-5.0-2P
  round 2.2 hole 1.4: 1(-2.5,0) 2(2.5,0)
IND-SMD_L12.3-W12.3
  rect 2.9x5.4 smd: 1(-5.45,0) 2(5.45,0)
KEY-SMD_L4.0-W3.0-LS4.9-1
  rect 1.3x1.7 smd: 1(-2.159,0) 2(2.159,0)
LED0603-RD_GREEN
  rect 0.8x0.8 smd: 1(-0.799,-0.004) 2(0.799,0.004)
LED0603-RD_RED
  rect 0.8x0.8 smd: 1(-0.799,-0.004) 2(0.799,0.004)
MOD-TH_ABX00028
  rect 1.6x1.6 hole 1: 1(-7.62,17.78)
  round 1.6 hole 1: 2(-7.62,15.24) 3(-7.62,12.7) 4(-7.62,10.16) 5(-7.62,7.62) 6(-7.62,5.08) 7(-7.62,2.54) 8(-7.62,0) 9(-7.62,-2.54) 10(-7.62,-5.08) 11(-7.62,-7.62) 12(-7.62,-10.16) 13(-7.62,-12.7) 14(-7.62,-15.24) 15(-7.62,-17.78) 16(7.62,-17.78) 17(7.62,-15.24) 18(7.62,-12.7) 19(7.62,-10.16) 20(7.62,-7.62) 21(7.62,-5.08) 22(7.62,-2.54) 23(7.62,0) 24(7.62,2.54) 25(7.62,5.08) 26(7.62,7.62) 27(7.62,10.16) 28(7.62,12.7) 29(7.62,15.24) 30(7.62,17.78)
Pad_e1
  round 4.572 hole 3.048: 1(0,0)
Pad_e2
  round 4.572 hole 3.048: 1(0,0)
Pad_e3
  round 4.572 hole 3.048: 1(0,0)
Pad_e106
  round 4.572 hole 3.048: 1(0,0)
POWERSO20_L15.9-W11.0-P1.27-LS14.2-BL-EP
  oval 0.651x2.696 smd: 1(-5.715,-6.647) 2(-4.445,-6.647) 3(-3.175,-6.647) 4(-1.905,-6.647) 5(-0.635,-6.647) 6(0.635,-6.647) 7(1.905,-6.647) 8(3.175,-6.647) 9(4.445,-6.647) 10(5.715,-6.647) 11(5.715,6.647) 12(4.445,6.647) 13(3.175,6.647) 14(1.905,6.647) 15(0.635,6.647) 16(-0.635,6.647) 17(-1.905,6.647) 18(-3.175,6.647) 19(-4.445,6.647) 20(-5.715,6.647)
  rect 15.9x6 smd: 21(0,0)
R0603
  rect 0.806x0.864 smd: 1(-0.753,0) 2(0.753,0)
SMA_L4.3-W2.6-LS5.2-RD
  rect 2x2 smd: 1(-2.2,0) 2(2.2,0)
SMAF_L3.5-W2.6-LS4.6-RD
  rect 1.8x2 smd: 1(-2.05,0) 2(2.05,0)
SOIC-8_L5.0-W4.0-P1.27-LS6.0-BL
  oval 0.569x1.95 smd: 1(-1.905,-2.705) 2(-0.635,-2.705) 3(0.635,-2.705) 4(1.905,-2.705) 5(1.905,2.705) 6(0.635,2.705) 7(-0.635,2.705) 8(-1.905,2.705)
SOP-8_L4.9-W3.9-P1.27-LS6.0-BL
  oval 0.63x1.865 smd: 1(-1.905,-2.683) 2(-0.635,-2.683) 3(0.635,-2.683) 4(1.905,-2.683) 5(1.905,2.683) 6(0.635,2.683) 7(-0.635,2.683) 8(-1.905,2.683)
TO-220-3_L10.0-W4.5-P2.54-L
  rect 1.8x2.6 hole 1.2: 1(-2.54,0.005)
  oval 1.8x2.6 hole 1.2: 2(0,0.005) 3(2.54,-0.005)
TO-263-5_L10.2-W8.9-P1.70-BR
  rect 3.083x1.02 smd: 1(5.16,-3.4) 2(5.16,-1.7) 3(5.16,0) 4(5.16,1.7) 5(5.16,3.4)
  rect 8.5x11 smd: 6(-5.16,0)

## Nets
As in the schematic.

Pads without a net: NOREF 1; NOREF#2 1; NOREF#3 1; NOREF#4 1; U3 3 18 21; U6 2 3 4 7 8 9 10 11 13 18 25 26 27 29; U11 8

## Via types
v1: diameter 0.61, hole 0.305, Top Layer to Bottom Layer, 83 vias

## Routing (per net, layer and track width the routed paths; a pad name or vN(x,y) marks a point on that pad's centre or on a via; arc(x,y) is an arc through that point)
5V: length 267.9
  Top Layer w0.5: R12.1 26.42,13.7 26.92,13.7 ; 32.76,20.45 U6.12 ; 32.76,20.45 32.76,18.45 v1(32.26,17.95) ; 32.76,20.45 32.63,20.33 32.63,19.33 29.63,16.33 29.13,16.33 29.13,15.91 28.28,15.06 ; U3.12 67.62,37.82 66.76,38.67 66.26,38.67 v1(65.76,38.17) 65.08,37.49 U3.14 ; 55.59,46.5 55.59,44 v1(55.26,43.67) ; 55.59,46.5 58.26,46.5 ; 55.59,46.5 55.59,49.18 ; 28.28,15.06 26.92,13.7 ; 28.28,15.06 25.42,15.06 24.92,15.56 24.92,16.92 25.74,17.74 R10.1 ; R9.1 13.29,17.2 v1(12.79,17.2) ; v1(66.85,15.3) 66.35,15.8 U3.8 ; 58.26,46.5 55.59,49.18 ; 58.26,46.5 62.59,46.5 63.59,47.5 63.59,50.4 60.59,53.4 58.59,53.4 SW4.1 ; 58.26,46.5 58.59,46.18 68.59,46.18 71.59,49.18 71.59,49.36 SW1.1 SW2.1 ; 21.4,8.2 C4.1 ; 21.4,8.2 21.4,10.3 C5.1 21.3,11.4 18.79,13.91 U8.8 ; 21.4,8.2 v1(23.7,8.2) 24.57,8.2 R13.1 ; 26.92,13.7 29.7,10.92 29.7,9.2 29.2,8.7 C6.1 27.7,8.2 v1(27.2,8.2) ; 55.59,49.18 SW3.1 ; v1(49.7,3.2) SW5.1 ; 58.1,3.29 v1(58.1,7.29) ; 58.1,3.29 U11.4 ; 58.1,3.29 v1(57.6,3.29) ; v1(48.26,17.95) 48.26,32.36 v1(49.26,33.36) ; v1(35.26,10.95) v1(35.26,8.45)
  Bottom Layer w0.5: v1(58.1,7.29) 58.85,7.29 v1(66.85,15.3) ; v1(49.26,33.36) 49.26,35.67 53.26,39.67 53.26,42.67 54.26,43.67 v1(55.26,43.67) 59.76,43.67 65.26,38.17 v1(65.76,38.17) ; v1(57.6,3.29) 40.42,3.29 v1(35.26,8.45) ; 35.26,11.95 35.26,13.45 32.26,16.45 v1(32.26,17.95) ; 35.26,11.95 v1(35.26,10.95) ; 35.26,11.95 36.26,10.95 41.26,10.95 v1(48.26,17.95) ; v1(12.79,17.2) 13.29,17.7 14.99,17.7 23.7,8.99 v1(23.7,8.2) v1(27.2,8.2) 32.2,3.2 v1(49.7,3.2)
GND: length 318
  Top Layer w0.5: v1(52.27,13.08) 48.77,16.58 48.77,16.7 ; U11.1 57.34,9.86 R21.1 55.49,10.36 v1(54.77,11.08) ; U11.1 61.39,8.4 73.3,8.4 U10.2 ; U11.1 60.09,5.84 ; D8.2 72.95,43.88 v1(69.68,43.88) 68.74,43.88 D9.2 D6.2 D7.2 57.83,43.69 R17.1 52.57,36.43 ; 14.4,10.9 16.9,10.9 17.4,10.4 C5.2 20,10.3 20,8.2 ; 14.4,10.9 14.34,10.9 R7.1 ; 14.4,10.9 11.4,13.9 11.4,17.4 12.7,18.7 16.32,18.7 U8.5 ; 48.77,16.7 50.99,18.92 52.77,18.92 53.55,19.7 R15.1 53.55,21.7 ; 48.77,16.7 C3.2 46.47,14.4 41.25,14.4 v1(39.25,12.4) ; 53.55,21.7 53.55,22.28 R14.1 ; 53.55,21.7 54.73,22.88 U3.1 U3.2 ; C2.2 36.39,56.5 25.92,46.03 D5.2 25.31,41.92 v1(23.02,41.92) 23.01,41.92 21.72,43.21 21.72,46.71 18.32,50.11 18.32,51.61 ; 20,8.2 20,7.4 20.5,6.9 25.5,6.9 26,7.4 ; 20,8.2 C4.2 ; v1(67.59,20.58) 68.09,20.58 68.89,21.38 U3.10 74.39,28.38 74.39,29.88 76.25,31.74 Q1.3 ; 52.57,36.43 57.2,36.43 U3.20 U3.19 ; 52.57,36.43 R16.1 ; C6.2 27.2,10.1 26,8.9 26,7.4 ; 18.32,51.61 11.38,51.61 LED1.1 6.5,51.8 U2.1 ; 18.32,51.61 U1.6 ; R3.2 35.25,16.5 35.25,16.9 ; 26,7.4 26.5,6.9 29,6.9 32.75,10.65 32.75,16.9 33.25,17.4 34.75,17.4 35.25,16.9 ; 35.25,16.9 v1(36.25,17.9) ; 18.32,43.21 18.32,41.63 v1(20.52,39.42) 30.76,39.42 U6.19 v1(32.76,31.76) ; v1(69.89,35.17) U3.11
  Bottom Layer w0.5: 69.28,44.28 v1(69.68,43.88) ; 69.28,44.28 69.28,44.07 68.89,43.67 U3.11 v1(69.89,35.17) 73.39,31.67 73.39,26.38 v1(67.59,20.58) 66.59,20.58 57.09,11.08 v1(54.77,11.08) 54.27,11.08 v1(52.27,13.08) ; 69.28,44.28 69.18,44.38 ; v1(20.52,39.42) v1(23.02,41.92) ; v1(39.25,12.4) 38.75,12.9 37.25,12.9 36.25,13.9 v1(36.25,17.9) 37.84,19.49 U6.14 37.84,26.68 v1(32.76,31.76)
VSS: length 78.7
  Top Layer w0.5: v1(34.93,53.52) 34.93,51.2 46.93,39.2 46.93,20.2 C3.1 40.86,16.2 39.02,14.36 C1.2 ; C1.2 36.36,12.2 R1.1 36.47,11.88 36.47,6.97 R19.1 ; C1.2 v1(37.52,14.36) ; L1.2 32.93,55.52 v1(32.93,55.02)
  Bottom Layer w0.5: U6.15 39.52,21.32 39.52,16.36 v1(37.52,14.36) ; v1(34.93,53.52) 34.43,53.52 v1(32.93,55.02)
VS: length 186.1
  Top Layer w0.5: U9.1 76.59,11.7 D4.1 D3.1 D1.1 ; 15.19,45.21 15.19,43.48 14.92,43.21 ; 15.19,45.21 17.19,47.21 19.19,47.21 v1(20.19,46.21) ; 15.19,45.21 12.43,45.21 R2.1 6.15,46.45 U2.2 ; D1.1 63.64,14.74 v1(61.31,17.07) ; D1.1 D2.1 55.43,14.24 51.93,10.74 48.82,10.74 47.12,9.03 ; v1(49.9,47.5) C2.1 ; v1(61.81,19.57) 63.81,21.57 U3.6
  Bottom Layer w0.5: v1(61.31,17.07) 61.31,19.07 v1(61.81,19.57) ; v1(20.19,46.21) 21.47,47.5 v1(49.9,47.5) 51.4,47.5 55.9,52 70.9,52 78.2,44.7 86.2,44.7 88.2,42.7 88.2,13.7 U9.1
$1N3030: length 67
  Top Layer w0.5: v1(59.77,39.28) 60.77,40.28 D6.1 63.66,40.9 v1(64.7,40.9) ; D1.2 61.14,18.34 60.27,19.21 60.27,19.71 61.27,20.71 U3.4 61.27,24.28 60.27,25.28 v1(58.27,25.28)
  Bottom Layer w0.5: U4.1 76.2,41.9 69.2,48.9 67.2,48.9 64.7,46.4 v1(64.7,40.9) ; v1(58.27,25.28) 56.27,27.28 56.27,37.78 58.27,39.78 59.27,39.78 v1(59.77,39.28)
$1N3036: length 72.3
  Top Layer w0.5: U4.2 81.7,42.4 59.95,42.4 D7.1 57.83,38.78 v1(58.33,38.28) ; D2.2 56.43,20.34 v1(56.43,21.34) ; U3.5 62.54,24.38 v1(62.33,24.58)
  Bottom Layer w0.5: v1(56.43,21.34) 56.93,21.84 63.08,21.84 65.83,24.58 65.83,25.58 65.33,26.08 63.83,26.08 v1(62.33,24.58) 60.48,24.58 57.33,27.73 57.33,37.28 v1(58.33,38.28)
$1N3042: length 57.2
  Top Layer w0.5: 82.7,31.8 74.2,40.3 73.7,40.3 ; 82.7,31.8 82.7,29.3 73.7,20.3 70.81,20.3 D3.2 ; 82.7,31.8 U5.1 ; U3.16 62.38,36.01 v1(62.38,34.51) ; 73.7,40.3 v1(72.2,38.8) ; 73.7,40.3 D8.1 ; v1(70.7,36.3) 71.2,35.8 71.2,34.8 70.2,33.8 v1(67.2,33.8)
  Bottom Layer w0.5: v1(72.2,38.8) 72.2,37.8 v1(70.7,36.3) ; v1(62.38,34.51) 63.59,33.3 66.7,33.3 v1(67.2,33.8)
$1N3046: length 55
  Top Layer w0.5: D4.2 79.05,18.34 88.2,27.48 88.2,31.3 U5.2 ; U3.17 61.38,36.28 61.38,37.78 61.88,38.28 64.38,38.28 66.38,40.28 D9.1 68.26,40.3 v1(71.2,40.3)
  Bottom Layer w0.5: v1(71.2,40.3) 79.2,40.3 U5.2
$1N3341: length 14.4
  Top Layer w0.5: U11.3 62.59,4.56 v1(63.09,4.06)
  Bottom Layer w0.5: v1(63.09,4.06) 72.63,4.06 U10.1
$1N3541: length 84.8
  Top Layer w0.5: v1(62,6.56) 62.5,6.56 64.5,4.56 65.5,4.56 ; v1(38.5,31.56) 37.5,30.56 16.75,30.56 U6.28
  Bottom Layer w0.5: v1(62,6.56) 61.5,6.06 57.5,6.06 57,6.56 54.5,6.56 52.25,4.31 49.75,4.31 49,5.06 49,7.06 51,9.06 51,21.56 41,31.56 v1(38.5,31.56)
$1N3558: length 100.3
  Top Layer w0.5: 65.5,5.84 66.5,5.84 67.5,4.84 67.5,2.84 66.5,1.84 v1(64,1.84)
  Bottom Layer w0.5: v1(64,1.84) 16,1.84 4.01,13.83 3.01,13.83 1.51,15.33 1.51,18.83 1.01,19.33 1.01,33.61 U6.30
$1N3567: length 71
  Top Layer w0.5: 65.5,3.29 63.92,3.29 61.92,1.29 55,1.29 53,3.29 53,4.79 51,6.79 v1(47.5,6.79)
  Bottom Layer w0.5: U6.1 6.7,20.3 14,20.3 24.5,9.79 44.5,9.79 v1(47.5,6.79)
$1N3578: length 90.3
  Top Layer w0.5: 69.12,48.71 69.12,48.21 v1(68.62,47.71) ; v1(53.96,23.76) 53.96,24.26 53.46,24.76 52.07,24.76 51.07,23.76 R14.2 ; v1(65.29,20.88) 65.08,21.09 U3.7 65.08,24.38 v1(64.58,24.88) ; v1(70.12,39.21) 72.62,36.71 72.62,30.71 v1(72.12,30.21)
  Bottom Layer w0.5: v1(70.12,39.21) 70.12,42.71 71.12,43.71 71.12,45.21 v1(68.62,47.71) ; U6.21 29.52,39.26 43.46,39.26 45.46,37.26 45.46,32.26 v1(53.96,23.76) 54.46,23.26 62.96,23.26 v1(64.58,24.88) ; v1(72.12,30.21) 72.12,27.71 v1(65.29,20.88)
$1N3584: length 88.8
  Top Layer w0.5: LED3.1 67.2,53.8 v1(67.2,47.3) ; v1(52.12,21.2) 52.12,20.27 R15.2 ; v1(67.62,25.39) U3.9
  Bottom Layer w0.5: v1(67.2,47.3) 67.2,36.3 69.12,34.39 69.12,27.89 67.62,26.39 v1(67.62,25.39) 67.62,24.89 63.43,20.7 58.62,20.7 58.12,20.2 53.12,20.2 v1(52.12,21.2) 52.12,22.2 38.62,35.7 26.86,35.7 U6.22
$1N4819: length 2.3
  Top Layer w0.5: R4.1 75.88,49.42 SW1.2
$1N4823: length 2
  Top Layer w0.5: SW2.2 75.93,56.35 R5.1
$1N4828: length 2.3
  Top Layer w0.5: SW3.2 59.97,49.62 R6.1
$1N4833: length 2.4
  Top Layer w0.5: SW4.2 59.79,56.55 R8.1
$1N4893: length 38.2
  Top Layer w0.5: v1(31.05,34.59) 31.05,36.59 U6.20 ; R20.1 38.55,10.04 v1(40.55,12.04)
  Bottom Layer w0.5: v1(40.55,12.04) 40.55,17.39 45.05,21.89 45.05,23.09 35.05,33.09 32.55,33.09 v1(31.05,34.59)
$1N6211: length 6.6
  Top Layer w0.5: SW5.2 55.76,3.89 R18.1
$1N6777: length 10.9
  Top Layer w0.5: R4.2 77.67,47.41 73.51,47.41 v1(73.01,47.91) ; LED2.2 69.61,50.31 v1(70.11,50.81)
  Bottom Layer w0.5: v1(70.11,50.81) v1(73.01,47.91)
$1N6840: length 11.5
  Top Layer w0.5: LED3.2 70.2,58.4 72.2,58.4 74.2,56.4 74.2,55.4 75.2,54.4 77.42,54.4 R5.2
$1N6942: length 11.9
  Top Layer w0.5: LED4.2 54.16,51.42 56.66,51.42 58.16,49.92 58.16,48.42 58.66,47.92 62.01,47.92 R6.2
$1N6949: length 80.1
  Top Layer w0.5: R16.2 49.67,36.8 49.67,39.82 52.17,42.32 ; 52.17,42.32 52.17,42.82 53.17,43.82 LED4.1 ; 52.17,42.32 v1(54.67,42.32) ; U3.13 66.17,35.99 v1(66.17,34.49)
  Bottom Layer w0.5: v1(54.67,42.32) 55.17,42.32 56.67,40.82 ; U6.23 25.6,40.42 44.06,40.42 47.06,37.42 47.06,33.92 49.06,31.92 49.56,31.92 50.56,32.92 50.56,34.71 56.67,40.82 ; 56.67,40.82 59.84,40.82 v1(66.17,34.49)
$1N6952: length 12
  Top Layer w0.5: R8.2 61.71,54.55 59.09,54.55 58.09,55.55 58.09,56.55 56.09,58.55 54.09,58.55 LED5.2
$1N6959: length 75.4
  Top Layer w0.5: 48.6,40.45 v1(50.1,41.95) 51.1,42.95 51.1,53.95 LED5.1 ; 48.6,40.45 48.6,35.95 51.1,33.45 63.1,33.45 63.81,34.16 U3.15 ; 48.6,40.45 47.6,40.45 v1(46.1,41.95) ; v1(51.07,39.49) R17.2
  Bottom Layer w0.5: v1(46.1,41.95) 24.59,41.95 U6.24 ; v1(50.1,41.95) 50.1,40.45 v1(51.07,39.49)
$1N7366: length 46
  Top Layer w0.5: v1(54.48,8.86) 53.98,9.36 ; 53.98,9.36 51.79,9.36 R18.2 v1(49.6,9.55) ; 53.98,9.36 R21.2 ; R20.2 41.57,11.05 45.1,11.05 v1(45.6,10.55)
  Bottom Layer w0.5: Q1.1 58.79,8.86 v1(54.48,8.86) ; v1(49.6,9.55) 46.6,9.55 v1(45.6,10.55)
$1N9309: length 68.3
  Top Layer w0.5: v1(54.02,7.53) 54.52,7.53 v1(57.02,5.03) ; 46.52,5.53 v1(50.52,5.53) ; 46.52,5.53 D10.2 ; 46.52,5.53 48.19,3.86 LED6.1
  Bottom Layer w0.5: 76.52,19.53 62.02,5.03 v1(57.02,5.03) ; 76.52,19.53 83.37,19.53 U9.2 ; 76.52,19.53 79.02,22.03 79.02,27.53 77.35,29.2 Q1.2 ; v1(54.02,7.53) 52.02,5.53 v1(50.52,5.53)
$1N10798: length 43.6
  Top Layer w0.5: U6.16 40.38,27.09 44.74,22.74 44.74,21.74 43.24,20.24 v1(36.24,20.24) ; R10.2 26.74,16.24 v1(27.24,16.74) ; U8.4 23.18,18.2 v1(23.77,18.2)
  Bottom Layer w0.5: v1(23.77,18.2) 25.24,16.74 v1(27.24,16.74) 30.74,20.24 v1(36.24,20.24)
$1N10809: length 56.9
  Top Layer w0.5: 22.68,13.1 22.68,11.6 R13.2 ; 22.68,13.1 v1(23.18,13.1) ; 22.68,13.1 U8.1 ; v1(35.68,19.1) 43.84,19.1 45.84,21.1 45.84,23.1 44.66,24.27 44.66,38.1 43.66,39.1 39.52,39.1 U6.17
  Bottom Layer w0.5: v1(35.68,19.1) 31.18,19.1 25.18,13.1 v1(23.18,13.1)
$1N10831: length 16.1
  Top Layer w0.5: R12.2 25.66,12.45 24.4,13.71 24.4,14.45 23.68,15.17 U8.2 21.18,15.17 19.18,17.17 19.18,17.98 U6.5
$1N10835: length 17.9
  Top Layer w0.5: R11.2 27.63,19.33 22.13,19.33 21.18,18.38 ; 21.18,18.38 20.68,17.88 20.68,17.38 21.63,16.44 U8.3 ; 21.18,18.38 21.18,18.52 U6.6
$1N11820: length 14.7
  Top Layer w0.5: R9.2 14.14,16.04 v1(14.53,16.44) U8.6
  Bottom Layer w0.5: U7.1 14.2,16.1 v1(14.53,16.44)
$1N11831: length 21
  Top Layer w0.5: v1(15.14,9.6) R7.2 5.3,9.6 U7.2 ; U8.7 17.25,15.1 16.14,15.1 15.14,14.1 15.14,13.6 16.64,12.1 v1(17.14,12.1)
  Bottom Layer w0.5: v1(15.14,9.6) 15.14,10.1 v1(17.14,12.1)
$1N15964: length 6.6
  Top Layer w0.5: LED6.2 42.78,2.17 R19.2
$1N33170: length 21
  Top Layer w0.5: L1.1 30.32,45.07 D5.1 28.32,42.53 v1(27.82,43.03) ; v1(19.13,45.71) 17.63,45.71 16.63,44.71 16.63,43.23 16.62,43.21
  Bottom Layer w0.5: v1(27.82,43.03) 21.82,43.03 v1(19.13,45.71)
$1N33171: length 64.4
  Top Layer w0.5: 20.02,43.21 20.02,41.71 21.02,40.71 43.52,40.71 45.87,38.36 v1(45.87,24.86) ; 34.88,14.86 36.52,14.86 38.02,16.36 C1.1 40.02,17.86 v1(42.52,17.86) ; 34.88,14.86 34.05,15.7 R3.1 ; 34.88,14.86 34.88,12.44 R1.2
  Bottom Layer w0.5: v1(42.52,17.86) 46.37,21.71 46.37,24.36 v1(45.87,24.86)
$1N33173: length 2.2
  Top Layer w0.5: LED1.2 11.2,47.96

## Copper pours and planes (outline as drawn; the poured copper is in the pictures)
GND on Top Layer: 0,60 89.92,60 89.92,0.05 0,0.05
GND on Bottom Layer: 0.18,60.05 89.91,60.05 89.91,-0.12 0.18,-0.12

## Text on the board
Top Silkscreen Layer: PWOER | Nano Every | MOTOR 1 | SOLENOID | MOTOR 2 | THERMO | -GND | 24V+ | MODBUS | Steam Wand Controller | V1.0 8/25
